# Altium schematic sheet pressure_adc.SchDoc
size A4; Organization: Badgerloop Electrical; Address1: 133 Engineering Research Building; Address2: 1500 Engineering Drive; Address3: Madison, Wi 53706
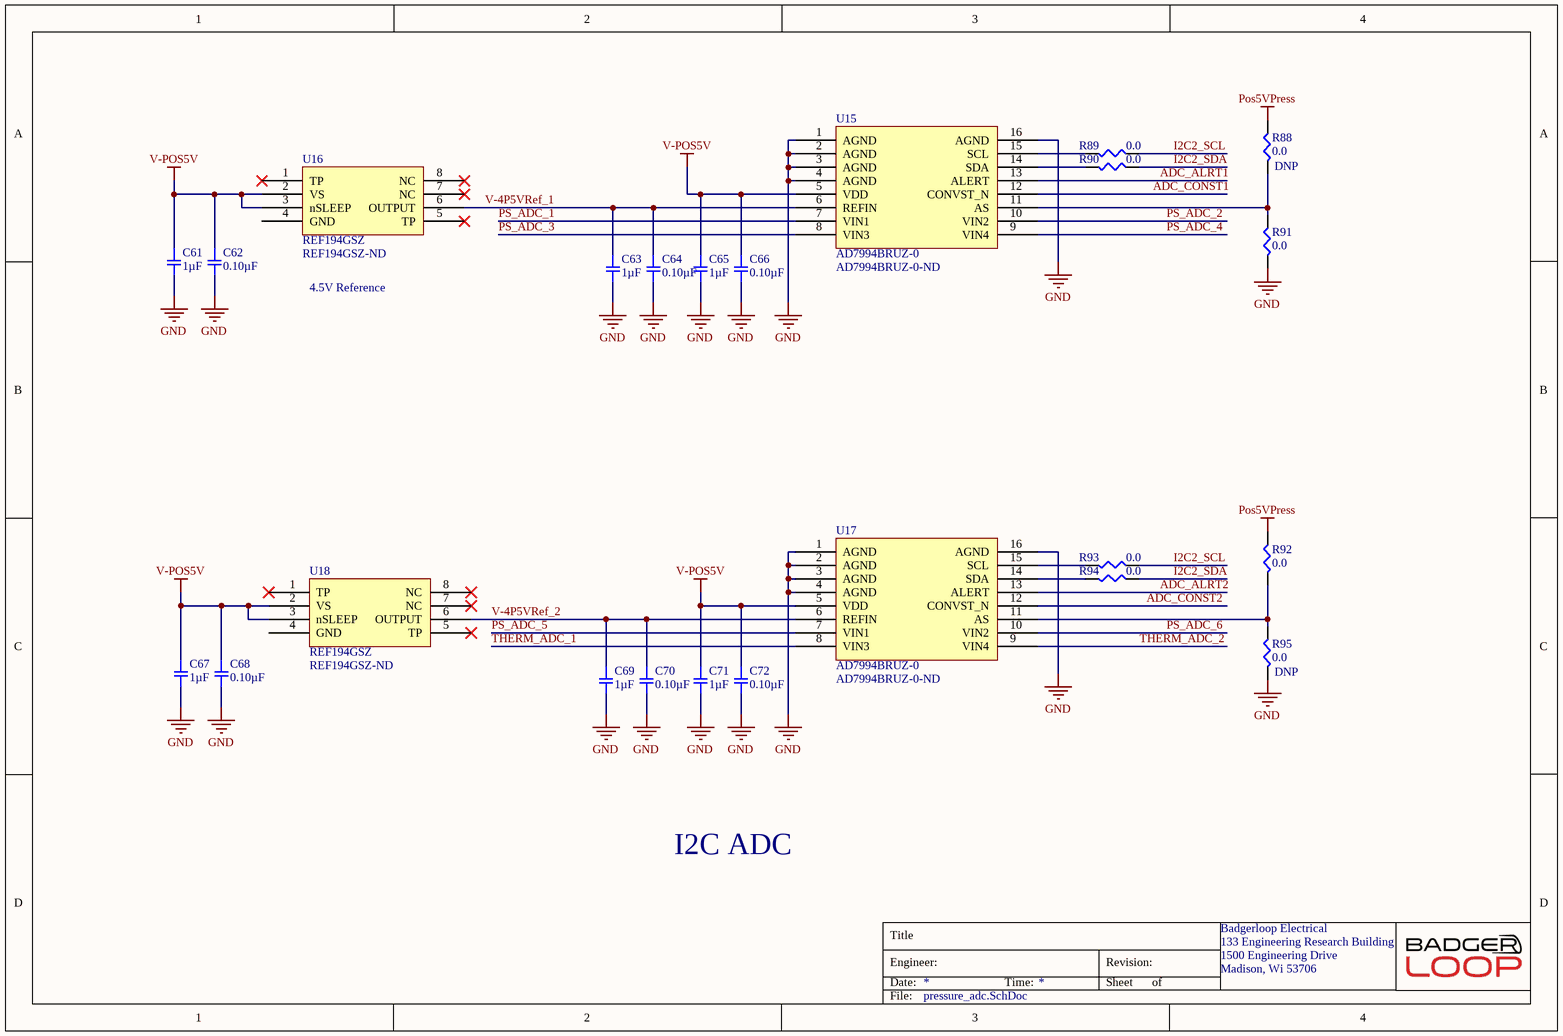
[diagram p0: pressure_adc.SchDoc]

## Parts
C61  1µF  [SMD-0805C]
C62  0.10µF  [SMD-0805C]
C63  1µF  [SMD-0805C]
C64  0.10µF  [SMD-0805C]
C65  1µF  [SMD-0805C]
C66  0.10µF  [SMD-0805C]
C67  1µF  [SMD-0805C]
C68  0.10µF  [SMD-0805C]
C69  1µF  [SMD-0805C]
C70  0.10µF  [SMD-0805C]
C71  1µF  [SMD-0805C]
C72  0.10µF  [SMD-0805C]
R88  0.0  [SMD-0805-RES]
R89  0.0  [SMD-0805-RES]
R90  0.0  [SMD-0805-RES]
R91  0.0  [SMD-0805-RES]
R92  0.0  [SMD-0805-RES]
R93  0.0  [SMD-0805-RES]
R94  0.0  [SMD-0805-RES]
R95  0.0  [SMD-0805-RES]
U15  AD7994BRUZ-0  Supplier Part Number 1: AD7994BRUZ-0-ND
U16  REF194GSZ  Supplier Part Number 1: REF194GSZ-ND  [SOP127P600X175-8N]
U17  AD7994BRUZ-0  Supplier Part Number 1: AD7994BRUZ-0-ND
U18  REF194GSZ  Supplier Part Number 1: REF194GSZ-ND  [SOP127P600X175-8N]

## Nets
GND: C61.2 C62.2 C63.2 C64.2 C65.2 C66.2 C67.2 C68.2 C69.2 C70.2 C71.2 C72.2 R91.2 R95.2 U15.1(AGND) U15.2(AGND) U15.3(AGND) U15.4(AGND) U15.16(AGND) U17.1(AGND) U17.2(AGND) U17.3(AGND) U17.4(AGND) U17.16(AGND)
Pos5VPress: R88.1 R92.1
V-POS5V: C61.1 C62.1 C65.1 C66.1 C67.1 C68.1 C71.1 C72.1 U15.5(VDD) U16.2(VS) U16.3(nSLEEP) U17.5(VDD) U18.2(VS) U18.3(nSLEEP)
ADC_ALRT1: U15.13(ALERT)
ADC_ALRT2: U17.13(ALERT)
ADC_CONST1: U15.12(CONVST_N)
ADC_CONST2: U17.12(CONVST_N)
I2C2_SCL: R89.1 R93.1
I2C2_SDA: R90.1 R94.1
PS_ADC_1: U15.7(VIN1)
PS_ADC_2: U15.10(VIN2)
PS_ADC_3: U15.8(VIN3)
PS_ADC_4: U15.9(VIN4)
PS_ADC_5: U17.7(VIN1)
PS_ADC_6: U17.10(VIN2)
THERM_ADC_1: U17.8(VIN3)
THERM_ADC_2: U17.9(VIN4)
V-4P5VRef_1: C63.1 C64.1 U15.6(REFIN) U16.6(OUTPUT)
V-4P5VRef_2: C69.1 C70.1 U17.6(REFIN) U18.6(OUTPUT)
NetR88_2: R88.2 R91.1 U15.11(AS)
NetR89_2: R89.2 U15.15(SCL)
NetR90_2: R90.2 U15.14(SDA)
NetR92_2: R92.2 R95.1 U17.11(AS)
NetR93_2: R93.2 U17.15(SCL)
NetR94_2: R94.2 U17.14(SDA)

Not connected (* = marked no-connect by the designer): U16 1(TP)* 4(GND) 5(TP)* 7(NC)* 8(NC)*; U18 1(TP)* 4(GND) 5(TP)* 7(NC)* 8(NC)*

## Notes on the sheet
- 4.5V Reference
- I2C ADC
- Title
- Engineer:
- Date:
- Time:
- Revision:
- Sheet
- of
- File:

## Library data of the parts
C61 C63 C65 C67 C69 C71 = GRM21BR71H105KA12L: CAP CER 1UF 50V X7R 0805; Manufacturer: Murata Electronics North America; Factory Stock: 0; Unit Price (USD): 0.25; Minimum Quantity: 1; Tolerance: ±10%; Datasheets: http://www.murata.com/~/media/webrenewal/support/library/catalog/products/capacitor/mlcc/c02e.pdf; Image: //media.digikey.com/Renders/Murata%20Renders/0805%20(2012%20Metric)%20.85mm.jpg; Digi-Key Part Number: 490-4736-1-ND; Part Number: GRM21BR71H105KA12L; Quantity Available: 988032; @ qty: 0; Packaging: Cut Tape (CT); Series: GRM; Part Status: Active; Value: 1µF; Voltage: 50V; Temperature Coefficient: X7R; Operating Temperature: -55°C ~ 125°C; Features: -; Ratings: -; Applications: General Purpose; Mounting Type: Surface Mount, MLCC; Package / Case: 0805 (2012 Metric); Size / Dimension: 0.079" L x 0.049" W (2.00mm x 1.25mm); Height - Seated (Max): -; Thickness (Max): 0.053" (1.35mm); Lead Spacing: -; Lead Style: -
C62 C64 C66 C68 C70 C72 = GCD21BR71H104KA01L: CAP CER 0.1UF 50V X7R 0805; Manufacturer: Murata Electronics North America; Factory Stock: 0; Unit Price (USD): 0.24; Minimum Quantity: 1; Tolerance: ±10%; Datasheets: http://www.murata.com/~/media/webrenewal/support/library/catalog/products/capacitor/mlcc/c03e.ashx; Image: //media.digikey.com/Renders/Murata%20Renders/0805%28GxM6%29.jpg; Digi-Key Part Number: 490-11955-1-ND; Part Number: GCD21BR71H104KA01L; Quantity Available: 157; @ qty: 0; Packaging: Cut Tape (CT); Series: GCD; Part Status: Active; Value: 0.10µF; Voltage: 50V; Temperature Coefficient: X7R; Operating Temperature: -55°C ~ 125°C; Features: -; Ratings: AEC-Q200; Applications: Automotive; Mounting Type: Surface Mount, MLCC; Package / Case: 0805 (2012 Metric); Size / Dimension: 0.079" L x 0.049" W (2.00mm x 1.25mm); Height - Seated (Max): -; Thickness (Max): 0.049" (1.25mm); Lead Spacing: -; Lead Style: -
R88-R95 = ERJ-6GEY0R00V: RES SMD 0.0 OHM JUMPER 1/8W 0805; Manufacturer: Panasonic Electronic Components; Factory Stock: 0; Unit Price (USD): 0.00544; @ qty: 1500; Minimum Quantity: 1; Power (Watts): 0.125W, 1/8W; Part Number: ERJ-6GEY0R00V; Datasheets: http://industrial.panasonic.com/www-cgi/jvcr13pz.cgi?E+PZ+3+AOA0001+ERJ6GEY0R00V+7+WW; Image: //media.digikey.com/Renders/Panasonic%20Renders/ERJ-0805%20Pkg.jpg; Digi-Key Part Number: P0.0ACT-ND; Quantity Available: 1597627; Packaging: Cut Tape (CT); Series: ERJ; Part Status: Active; Value: 0.0; Tolerance: Jumper; Composition: Thick Film; Features: Automotive AEC-Q200; Temperature Coefficient: -; Operating Temperature: -55°C ~ 155°C; Package / Case: 0805 (2012 Metric); Supplier Device Package: 0805; Size / Dimension: 0.079" L x 0.049" W (2.00mm x 1.25mm); Height - Seated (Max): 0.028" (0.70mm); Number of Terminations: 2; Failure Rate: -
  R88 R95: DNP: DNP
U15 U17 = AD7994BRUZ-0: ANALOG DEVICES - AD7994BRUZ-0 - 12BIT ADC, 4CH I2C I/F, SMD, 7994; Resolution: 12b; Sampling Rate: 188KS/s; Number of A/D Converters: 1; Number of Analog Inputs: 4; Polarity: Unipolar; Max Power Dissipation: 6.05mW; Max Supply Voltage: 5.5V; Min Supply Voltage: 2.7V; Interface: I2C,2-Wire; Power Consumption: 2.31mW; Signal to Noise Ratio (SNR): 71dB; Number of Bits: 12; Power Dissipation: 6mW; Integral Nonlinearity (INL): 1LSB; Differential Nonlinearity: -0.9LSB; Input Capacitance: 30pF; Min Input Voltage: 1.2V; Full Scale Error: 2LSB; Supply Type: Single; Operating Supply Voltage: 5V; Supplier 1: Digi-Key; Manufacturer: Analog Devices; Manufacturer Part Number: AD7994BRUZ-0; Stock 1: 188; Pricing 1: 1=10.29000, 10=9.29400, 25=8.86160, 100=7.69460, 250=7.34876, 500=6.70034 (USD); RoHS: Yes; Case/Package: TSSOP; Number of Pins: 16; Contact Plating: Tin,Matte; Min Operating Temperature: -40°C; Max Operating Temperature: 85°C; Package Quantity: 96; Number of Channels: 4; Packaging: Rail/Tube; Number of Converters: 1; Number of Inputs: 4; Max Input Voltage: 5.5V; Number of Elements: 1; Length: 5mm; Height: 1.05mm; Width: 4.4mm; Radiation Hardening: No; Lead Free: Contains Lead; REACH SVHC: No SVHC; ComponentLink1URL: https://datasheet.ciiva.com/26799/ad7994bruz-0-26799795.pdf?src-supplier=IIIC; ComponentLink1Description: https://datasheet.ciiva.com/26799/ad7994bruz-0-26799795.pdf?src-supplier=IIIC; ComponentLink2URL: https://datasheet.ciiva.com/1702/1610633-1702675.pdf?src-supplier=Element14; ComponentLink2Description: https://datasheet.ciiva.com/1702/1610633-1702675.pdf?src-supplier=Element14; ComponentLink3URL: https://datasheet.ciiva.com/6664/ad7993-7994-6664968.pdf?src-supplier=Digi-Key; ComponentLink3Description: https://datasheet.ciiva.com/6664/ad7993-7994-6664968.pdf?src-supplier=Digi-Key; ComponentLink4URL: https://datasheet.ciiva.com/15147/getdatasheetpartid-143461-15147723.pdf?src-supplier=Verical; ComponentLink4Description: https://datasheet.ciiva.com/15147/getdatasheetpartid-143461-15147723.pdf?src-supplier=Verical; ComponentLink5URL: https://datasheet.ciiva.com/3037/ad7993-7994-3037820.pdf?src-supplier=Avnet; ComponentLink5Description: https://datasheet.ciiva.com/3037/ad7993-7994-3037820.pdf?src-supplier=Avnet
U16 U18 = REF194GSZ: IC VREF SERIES 4.5V 8SOIC; Manufacturer: Analog Devices; Max Input Voltage: 18V; Max Output Current: 30mA; Temperature Coefficient: 25ppm/°C; Number of Channels: 1; Min Output Voltage: 4.49V; Operating Supply Current: 45uA; Quiescent Current: 15uA; Min Input Voltage: 4.75V; Supplier 1: Digi-Key; Manufacturer Part Number: REF194GSZ; Stock 1: 359; Pricing 1: 1=3.56000, 10=3.19700, 25=3.02240, 100=2.61940, 250=2.48512, 500=2.22988, 1000=1.88062, 2500=1.78659 (USD); RoHS: Yes; Case/Package: R; Number of Pins: 8; Min Operating Temperature: -40°C; Max Operating Temperature: 85°C; Output Voltage: 4.5V; Packaging: Rail/Tube; Output Current: 30mA; Max Output Voltage: 4.5V; Reference Type: Series; Package Quantity: 98; Nominal Supply Current: 45uA; Reference Voltage: 4.5V; Length: 5mm; Height: 1.5mm; Width: 4mm; Radiation Hardening: No; Lead Free: Contains Lead; REACH SVHC: No SVHC; ComponentLink1URL: https://datasheet.ciiva.com/17219/ref19xseries-17219157.pdf?src-supplier=Avnet+Europe; ComponentLink1Description: https://datasheet.ciiva.com/17219/ref19xseries-17219157.pdf?src-supplier=Avnet+Europe; ComponentLink2URL: https://datasheet.ciiva.com/22666/1506113-22666153.pdf?src-supplier=Element14; ComponentLink2Description: https://datasheet.ciiva.com/22666/1506113-22666153.pdf?src-supplier=Element14; ComponentLink3URL: https://datasheet.ciiva.com/2005/ref19xseries-2005902.pdf?src-supplier=Digi-Key; ComponentLink3Description: https://datasheet.ciiva.com/2005/ref19xseries-2005902.pdf?src-supplier=Digi-Key; ComponentLink4URL: https://datasheet.ciiva.com/3235/ref19xseries-3235518.pdf?src-supplier=Avnet; ComponentLink4Description: https://datasheet.ciiva.com/3235/ref19xseries-3235518.pdf?src-supplier=Avnet